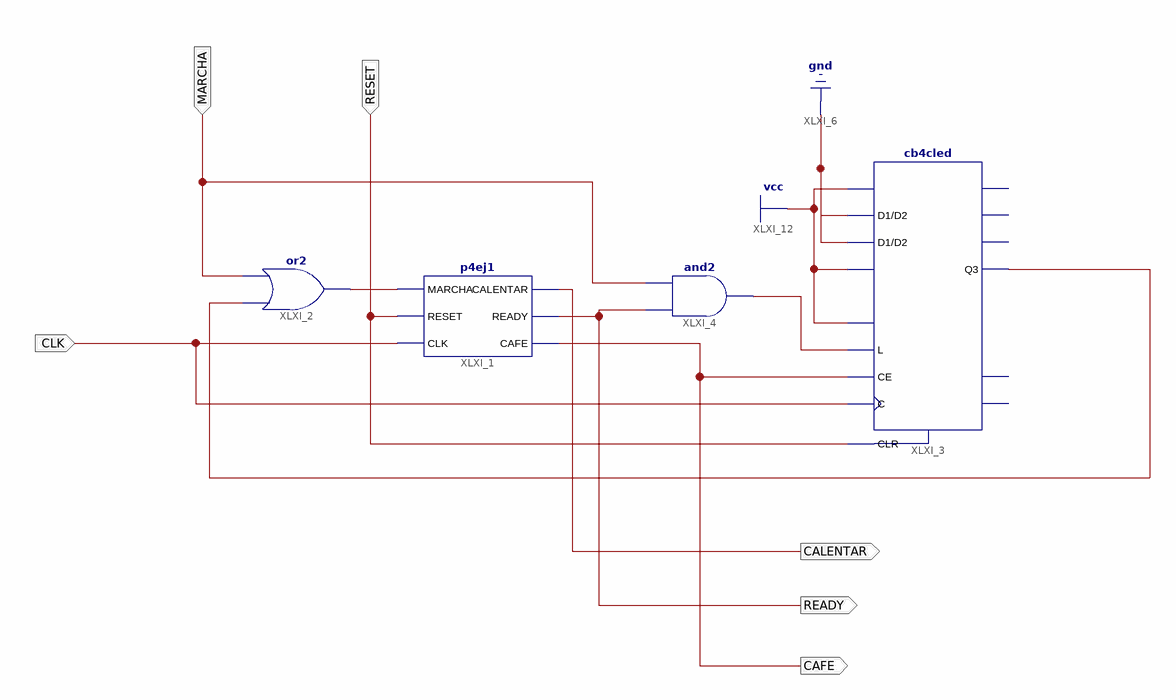
[diagram p0: schematic sheet 1]
// Xilinx ISE schematic p4ej2.sch (spartan3) as structural Verilog: 4 symbols, 6 ports
module p4ej2 (
  input  MARCHA,
  input  RESET,
  input  CLK,
  output CAFE,
  output READY,
  output CALENTAR
);

  wire XLXN_1, XLXN_7, XLXN_24;

  p4ej1 XLXI_1 (.CAFE(CAFE), .CALENTAR(CALENTAR), .CLK(CLK), .MARCHA(XLXN_1), .READY(READY), .RESET(RESET));
  or XLXI_2 (XLXN_1, XLXN_24, MARCHA);
  cb4cled XLXI_3 (
    .C(CLK), .CE(CAFE), .CLR(RESET), .D0(1'b1), .D1(1'b0), .D2(1'b0), .D3(1'b1), .L(XLXN_7), .UP(1'b1),
    .Q3(XLXN_24));  // open: CEO, Q0, Q1, Q2, TC
  and XLXI_4 (XLXN_7, READY, MARCHA);
endmodule
